# EAGLE design xbee_raspberry_extension_card (EAGLE 6.6.0)
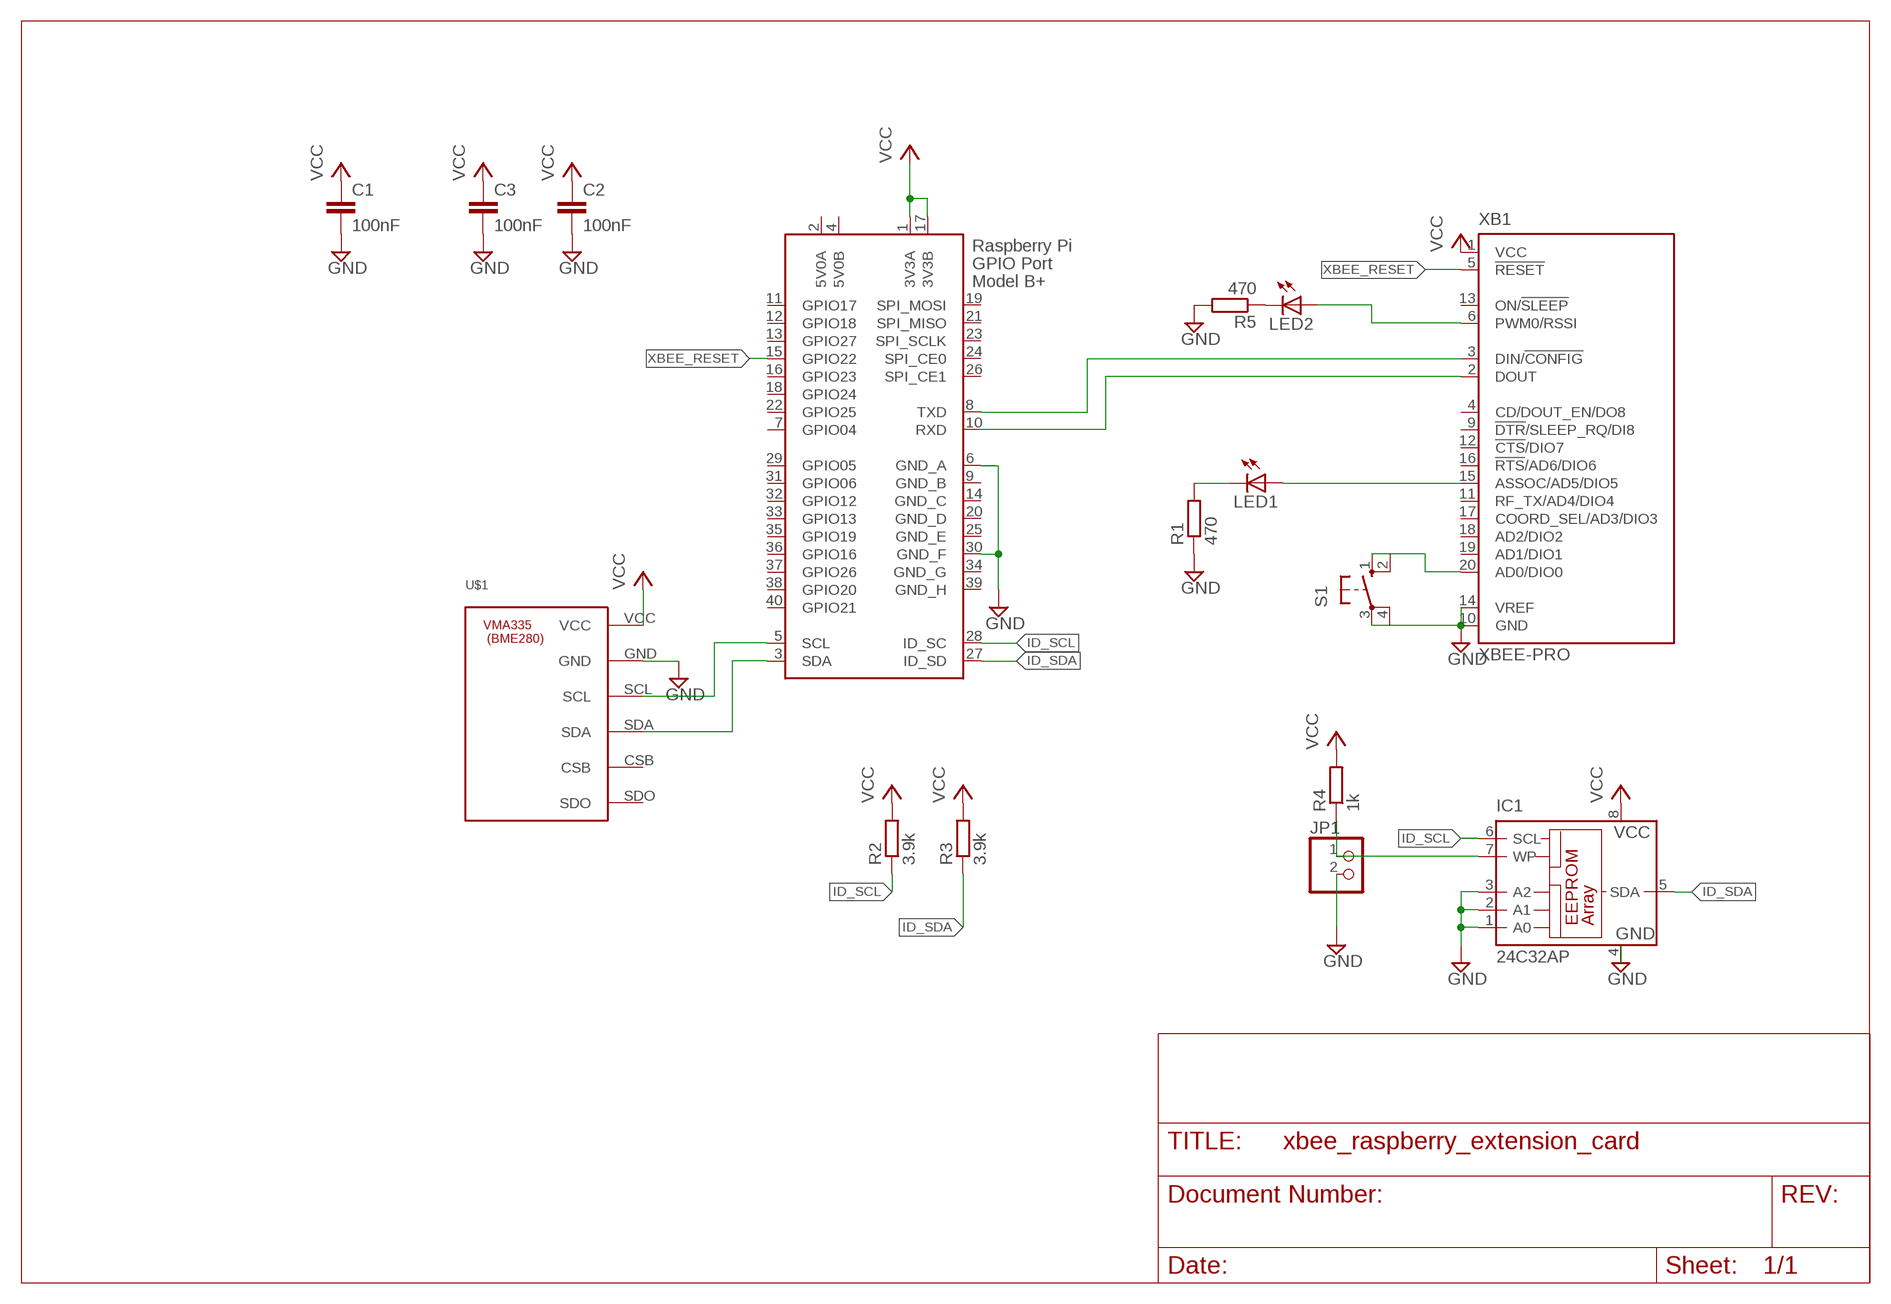
[diagram p0: schematic, sheet 1]

## Parts
C1  100nF  C-EU050-030X075  [C050-030X075]
C2  100nF  C-EU050-030X075  [C050-030X075]
C3  100nF  C-EU050-030X075  [C050-030X075]
IC1  24C32AP  [DIL8]
JP1  PINHD-1X2  [1X02]
LED1  LED3MM  [LED3MM]
LED2  LED3MM  [LED3MM]
R1  470  R-EU_0204/7  [0204/7]
R2  3.9k  R-EU_0204/7  [0204/7]
R3  3.9k  R-EU_0204/7  [0204/7]
R4  1k  R-EU_0204/7  [0204/7]
R5  470  R-EU_0204/7  [0204/7]
S1  10-XX  [B3F-10XX]
U$1  VMA335-BME280  [VMA335_P]
X1  RASPI_BOARD_B+#_HDC  [RASPI_BOARD_B+HAT_DF_CF]
XB1  XBEE-PRO  [XBEE-PRO]

## Nets
GND: C1.2 C2.2 C3.2 IC1.1(A0) IC1.2(A1) IC1.3(A2) IC1.4(GND) JP1.2 R1.1 R5.2 S1.3(P) S1.4(P1) U$1.GND X1.6(GND_A) X1.30(GND_F) XB1.10(GND) XB1.14(VREF)
ID_SCL: IC1.6(SCL) R2.1 X1.28(ID_SC)
ID_SDA: IC1.5(SDA) R3.1 X1.27(ID_SD)
N$1: X1.10(RXD) XB1.2(DOUT)
N$2: X1.8(TXD) XB1.3(DIN/!CONFIG)
N$3: U$1.SCL X1.5(SCL)
N$4: U$1.SDA X1.3(SDA)
N$5: IC1.7(WP) JP1.1 R4.1
N$6: LED1.A XB1.15(ASSOC/AD5/DIO5)
N$7: LED1.K(C) R1.2
N$8: S1.1(S) S1.2(S1) XB1.20(AD0/DIO0)
N$9: LED2.K(C) R5.1
N$10: LED2.A XB1.6(PWM0/RSSI)
VCC: C1.1 C2.1 C3.1 IC1.8(VCC) R2.2 R3.2 R4.2 U$1.VCC X1.1(3V3A) X1.17(3V3B) XB1.1(VCC)
XBEE_RESET: X1.15(GPIO22) XB1.5(!RESET)
Unconnected: U$1.CSB U$1.SDO X1.7(GPIO04) X1.11(GPIO17) X1.12(GPIO18) X1.13(GPIO27) X1.16(GPIO23) X1.18(GPIO24) X1.19(SPI_MOSI) X1.21(SPI_MISO) X1.22(GPIO25) X1.23(SPI_SCLK) X1.24(SPI_CE0) X1.26(SPI_CE1) X1.29(GPIO05) X1.31(GPIO06) X1.32(GPIO12) X1.33(GPIO13) X1.35(GPIO19) X1.36(GPIO16) X1.37(GPIO26) X1.38(GPIO20) X1.40(GPIO21) XB1.4(CD/DOUT_EN/DO8) XB1.9(!DTR!/SLEEP_RQ/DI8) XB1.11(RF_TX/AD4/DIO4) XB1.12(!CTS!/DIO7) XB1.13(ON/!SLEEP) XB1.16(!RTS!/AD6/DIO6) XB1.17(COORD_SEL/AD3/DIO3) XB1.18(AD2/DIO2) XB1.19(AD1/DIO1)

## Power pins joined to a net without a drawn wire
5V0A: X1.2(5V0A)
5V0B: X1.4(5V0B)
GND_B: X1.9(GND_B)
GND_C: X1.14(GND_C)
GND_D: X1.20(GND_D)
GND_E: X1.25(GND_E)
GND_G: X1.34(GND_G)
GND_H: X1.39(GND_H)

## Library data of the parts
C1-C3 = rcl:C-EU: CAPACITOR, European symbol
IC1 = microchip:24*: Serial EEPROM I2C; MPN: AT24C32C-PU; OC_FARNELL: 1362652; OC_NEWARK: 50M3325
JP1 = pinhead:PINHD-1X2: PIN HEADER
LED1 LED2 = led:LED: LED OSRAM: - CHIPLED LG R971, LG N971, LY N971, LG Q971, LY Q971, LO R971, LY R971 LH N974, LH R974 LS Q976, LO Q976, LY Q976 LO Q996 - Hyper CHIPLED LW Q18S LB Q993, LB Q99A, LB R99A - SideLED LS A670, LO A670, LY A670, LG A670, LP A670 LB A673, LV A673, LT A673, LW A673 LH A674 LY A675 LS A676, LA A676, LO A676, LY A676, LW A676 LS A679, LY A679, LG A679 - Hyper Micro SIDELED® LS Y876, LA Y876, LO Y876, LY Y876 LT Y87S - SmartLED LW L88C, LW L88S LB L89C, LB L89S, LG L890 LS L89K, LO L89K, LY L89K LS L896, LA L896, LO L896, LY L896 - TOPLED LS T670, LO T670, LY T670, LG T670, LP T670 LSG T670, LSP T670, LSY T670, LOP T670, LYG T670 LG T671, LOG T671, LSG T671 LB T673, LV T673, LT T673, LW T673 LH T674 LS T676, LA T676, LO T676, LY T676, LB T676, LH T676, LSB T676, LW T676 LB T67C, LV T67C, LT T67C, LS T67K, LO T67K, LY T67K, LW E67C LS E67B, LA E67B, LO E67B, LY E67B, LB E67C, LV E67C, LT E67C LW T67C LS T679, LY T679, LG T679 LS T770, LO T770, LY T770, LG T770, LP T770 LB T773, LV T773, LT T773, LW T773 LH T774 LS E675, LA E675, LY E675, LS T675 LS T776, LA T776, LO T776, LY T776, LB T776 LHGB T686 LT T68C, LB T68C - Hyper Mini TOPLED® LB M676 - Mini TOPLED Santana® LG M470 LS M47K, LO M47K, LY M47K Source: http://www.osram.convergy.de LUXEON: - LUMILED® LXK2-PW12-R00, LXK2-PW12-S00, LXK2-PW14-U00, LXK2-PW14-V00 LXK2-PM12-R00, LXK2-PM12-S00, LXK2-PM14-U00 LXK2-PE12-Q00, LXK2-PE12-R00, LXK2-PE12-S00, LXK2-PE14-T00, LXK2-PE14-U00 LXK2-PB12-K00, LXK2-PB12-L00, LXK2-PB12-M00, LXK2-PB14-N00, LXK2-PB14-P00, LXK2-PB14-Q00 LXK2-PR12-L00, LXK2-PR12-M00, LXK2-PR14-Q00, LXK2-PR14-R00 LXK2-PD12-Q00, LXK2-PD12-R00, LXK2-PD12-S00 LXK2-PH12-R00, LXK2-PH12-S00 LXK2-PL12-P00, LXK2-PL12-Q00, LXK2-PL12-R00 Source: www.luxeon.com KINGBRIGHT: KA-3528ASYC Source: www.kingbright.com
R1-R5 = rcl:R-EU_: RESISTOR, European symbol
S1 = switch-omron:10-XX: OMRON SWITCH; MPN: B3F-1000; OC_FARNELL: 176432; OC_NEWARK: 36M3542
U$1 = ma_libs:VMA335-BME280
X1 = raspberrypi_bastelstube_v13:RASPI_BOARD_B+#: Raspberry Pi GPIO connector with markings for the outer dimensions of the Raspberry Pi board model B+ with different sets of drill holes or mounting pads All pins connected
XB1 = maxstream:XBEE: XBee (TM) /XBee-PRO(TM) OEM RF Modules Source: MaxStream, Inc. xbee_productmanual.pdf; MPN: XBP24-AWI-001; OC_FARNELL: 1337916; OC_NEWARK: 42M2667

## Board
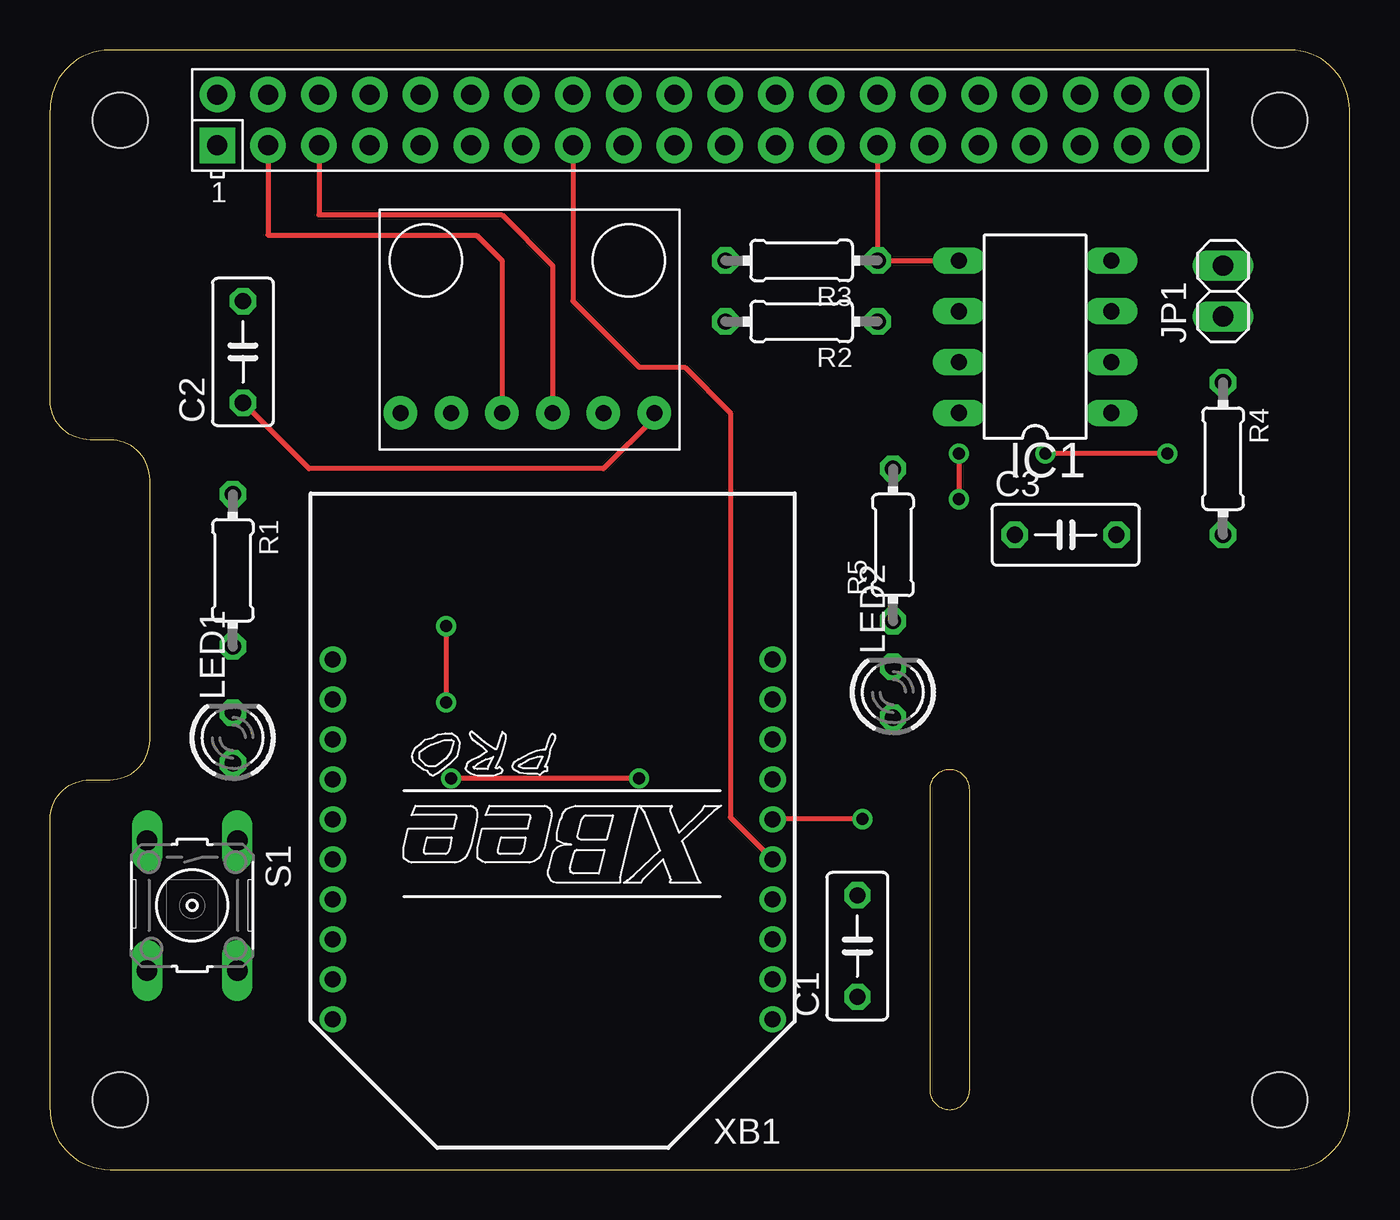
[diagram p1: board, top side]
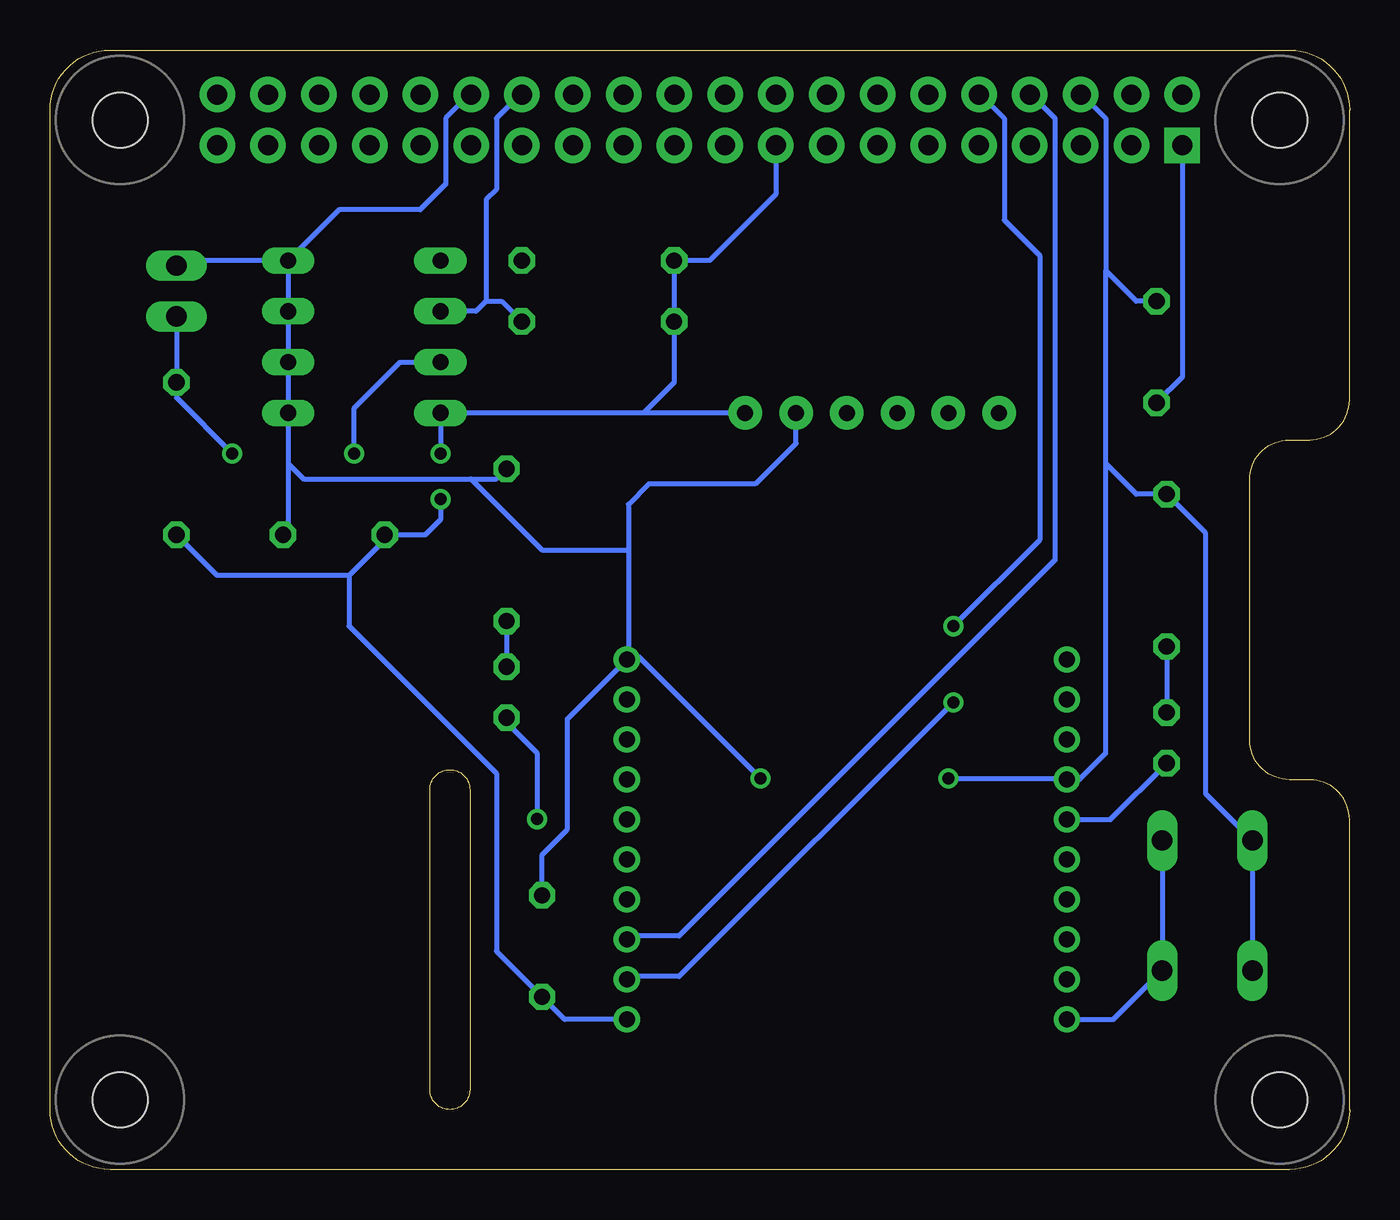
[diagram p2: board, bottom side, seen from below]

Size 65 x 56 mm. Coordinates in mm from the lower left corner, seen from the top.
Copper layers (1*16): Top 0.035mm / dielectric 1.5mm / Bottom 0.035mm
Design rules "default": minimum track width 10mil, minimum drill 24mil, track to track 8mil, track to pad 8mil, pad to pad 8mil, via to via 8mil, smd to smd 8mil, copper to edge 40mil, drill to drill 8mil, minimum pad ring 10mil, minimum via ring 8mil, stop-mask expansion 4mil, vias tented up to drill 0mil, thermal gap 10mil

### Footprints (pad centres in the part's own frame; a part is rotated, then mirrored left to right if it is on the bottom)
C050-030X075 = drill 0.813 octagon: 1 -2.54,0; 2 2.54,0
DIL8 = drill 0.813 long: 1 -3.81,-3.81; 2 -1.27,-3.81; 3 1.27,-3.81; 4 3.81,-3.81; 5 3.81,3.81; 6 1.27,3.81; 7 -1.27,3.81; 8 -3.81,3.81
1X02 = drill 1.016 long: 1 -1.27,0; 2 1.27,0
LED3MM = drill 0.813 octagon: A -1.27,0; K 1.27,0
0204/7 = drill 0.813 octagon: 1 -3.81,0; 2 3.81,0
B3F-10XX = drill 1.016 long: 1 -3.251,2.261; 2 3.251,2.261; 3 -3.251,-2.261; 4 3.251,-2.261
VMA335_P = drill 0.8 pad 1.676: CSB 11.43,10.16; GND 3.81,10.16; SCL 6.35,10.16; SDA 8.89,10.16; SDO 13.97,10.16; VCC 1.27,10.16
RASPI_BOARD_B+HAT_DF_CF = drill 1 pad 1.778 square: 1 8.37,51.23 | drill 1 pad 1.778: 2 8.37,53.77; 3 10.91,51.23; 4 10.91,53.77; 5 13.45,51.23; 6 13.45,53.77; 7 15.99,51.23; 8 15.99,53.77; 9 18.53,51.23; 10 18.53,53.77; 11 21.07,51.23; 12 21.07,53.77; 13 23.61,51.23; 14 23.61,53.77; 15 26.15,51.23; 16 26.15,53.77; 17 28.69,51.23; 18 28.69,53.77; 19 31.23,51.23; 20 31.23,53.77; 21 33.77,51.23; 22 33.77,53.77; 23 36.31,51.23; 24 36.31,53.77; 25 38.85,51.23; 26 38.85,53.77; 27 41.39,51.23; 28 41.39,53.77; 29 43.93,51.23; 30 43.93,53.77; 31 46.47,51.23; 32 46.47,53.77; 33 49.01,51.23; 34 49.01,53.77; 35 51.55,51.23; 36 51.55,53.77; 37 54.09,51.23; 38 54.09,53.77; 39 56.63,51.23; 40 56.63,53.77 | hole 2.75: 3.5,3.5; 3.5,52.5; 61.5,3.5; 61.5,52.5
XBEE-PRO = drill 0.8 pad 1.27: 1 -11,9; 2 -11,7; 3 -11,5; 4 -11,3; 5 -11,1; 6 -11,-1; 7 -11,-3; 8 -11,-5; 9 -11,-7; 10 -11,-9; 11 11,-9; 12 11,-7; 13 11,-5; 14 11,-3; 15 11,-1; 16 11,1; 17 11,3; 18 11,5; 19 11,7; 20 11,9

### Placement (x,y rotation side)
C1  40.39,11.18 90 top
C2  9.65,40.89 90 top
C3  50.8,31.75 0 top
IC1  49.28,41.66 90 top
JP1  58.67,43.94 90 top
LED1  9.14,21.59 90 top
LED2  42.16,23.88 90 top
R1  9.14,29.97 270 top
R2  37.59,42.42 180 top
R3  37.59,45.47 180 top
R4  58.67,35.56 270 top
R5  42.16,31.24 90 top
S1  7.11,13.21 270 top
U$1  31.5,48.01 180 top
X1  0,0 0 top
XB1  25.15,16.51 180 top

### Tracks (layer width: path | path; a pad name or v marks a point on that pad's centre or on a via)
GND  (via drill 0.6)
  Top 0.254: v29.46,19.56 v20.07,19.56
  Bottom 0.254: X1.6 13.38,53.77 12.19,52.58 12.19,44.96 | 12.19,44.96 10.67,43.43 C2.2 | X1.30 44.02,53.77 45.21,52.58 45.21,49.28 46.48,48.01 50.55,48.01 IC1.4 | IC1.4 58.42,45.47 JP1.2 | IC1.4 IC1.3 IC1.2 IC1.1 53.09,35.31 | 53.09,35.31 53.09,32 C3.2 | 36.07,25.65 36.07,25.59 XB1.10 39.12,22.54 39.12,17.02 40.39,15.75 C1.2 | S1.4 S1.3 7.19,18.8 7.19,31.83 R1.1 10.67,33.78 12.19,35.31 | U$1.GND 27.69,36.32 29.72,34.29 35.05,34.29 36.07,33.27 36.07,30.99 | 36.07,30.99 36.07,25.65 | 36.07,25.65 35.56,25.65 v29.46,19.56 | v20.07,19.56 14.19,19.56 XB1.14 13.51,19.51 12.19,20.83 12.19,35.31 | 12.19,35.31 12.19,44.96 | 36.07,30.99 40.39,30.99 43.94,34.54 | 42.42,34.8 R5.2 42.67,34.54 43.94,34.54 | 53.09,35.31 52.32,34.54 43.94,34.54
ID_SCL
  Bottom 0.254: X1.28 41.48,53.77 42.67,52.58 42.67,49.02 43.18,48.51 43.18,43.43 | 43.18,43.43 43.69,42.93 IC1.6 | 43.18,43.43 42.42,43.43 R2.1
ID_SDA
  Top 0.254: X1.27 R3.1 IC1.5
  Bottom 0.254: R3.1
N$1  (via drill 0.6)
  Top 0.254: v19.81,27.18 v19.81,23.37
  Bottom 0.254: X1.10 18.46,53.77 17.27,52.58 17.27,47.5 15.49,45.72 15.49,31.5 v19.81,27.18 | v19.81,23.37 33.53,9.65 36,9.65 XB1.2
N$2
  Bottom 0.254: X1.8 15.92,53.77 14.73,52.58 14.73,30.48 33.53,11.68 35.97,11.68 XB1.3
N$3
  Top 0.254: X1.5 13.45,47.76 13.46,47.75 22.61,47.75 25.15,45.21 U$1.SCL
N$4
  Top 0.254: X1.3 10.91,46.75 10.92,46.74 21.34,46.74 22.61,45.47 U$1.SDA
N$5  (via drill 0.6)
  Top 0.254: v55.88,35.81 v49.78,35.81
  Bottom 0.254: JP1.1 R4.1 58.67,38.61 v55.88,35.81 | v49.78,35.81 49.78,38.1 47.5,40.39 IC1.7
N$6
  Bottom 0.254: XB1.15 11.95,17.51 LED1.A
N$7
  Bottom 0.254: R1.2 LED1.K
N$8
  Bottom 0.254: XB1.20 11.82,7.51 S1.2 S1.1
N$9
  Bottom 0.254: R5.1 LED2.K
N$10  (via drill 0.6)
  Top 0.254: v40.64,17.53 36.16,17.53 XB1.6
  Bottom 0.254: LED2.A 42.16,22.35 40.64,20.83 v40.64,17.53
VCC  (via drill 0.6)
  Top 0.254: v45.47,35.81 v45.47,33.53 | U$1.VCC 30.23,37.59 27.69,35.05 12.95,35.05 C2.1
  Bottom 0.254: 50.04,29.72 48.26,31.5 C3.1 46.23,31.75 45.47,32.51 v45.47,33.53 | 50.04,29.72 56.64,29.72 R4.2 | XB1.1 39.26,7.51 C1.1 42.67,10.92 42.67,19.81 50.04,27.18 50.04,29.72 | X1.17 28.69,48.78 32,45.47 R3.2 R2.2 33.78,39.37 35.31,37.85 | U$1.VCC 35.31,37.85 | 35.31,37.85 IC1.8 v45.47,35.81 | X1.1 8.37,39.64 C2.1
XBEE_RESET
  Top 0.254: X1.15 26.15,43.45 29.46,40.13 31.75,40.13 34.04,37.85 34.04,17.62 XB1.5